# Altium schematic sheet uC.SchDoc
size A4
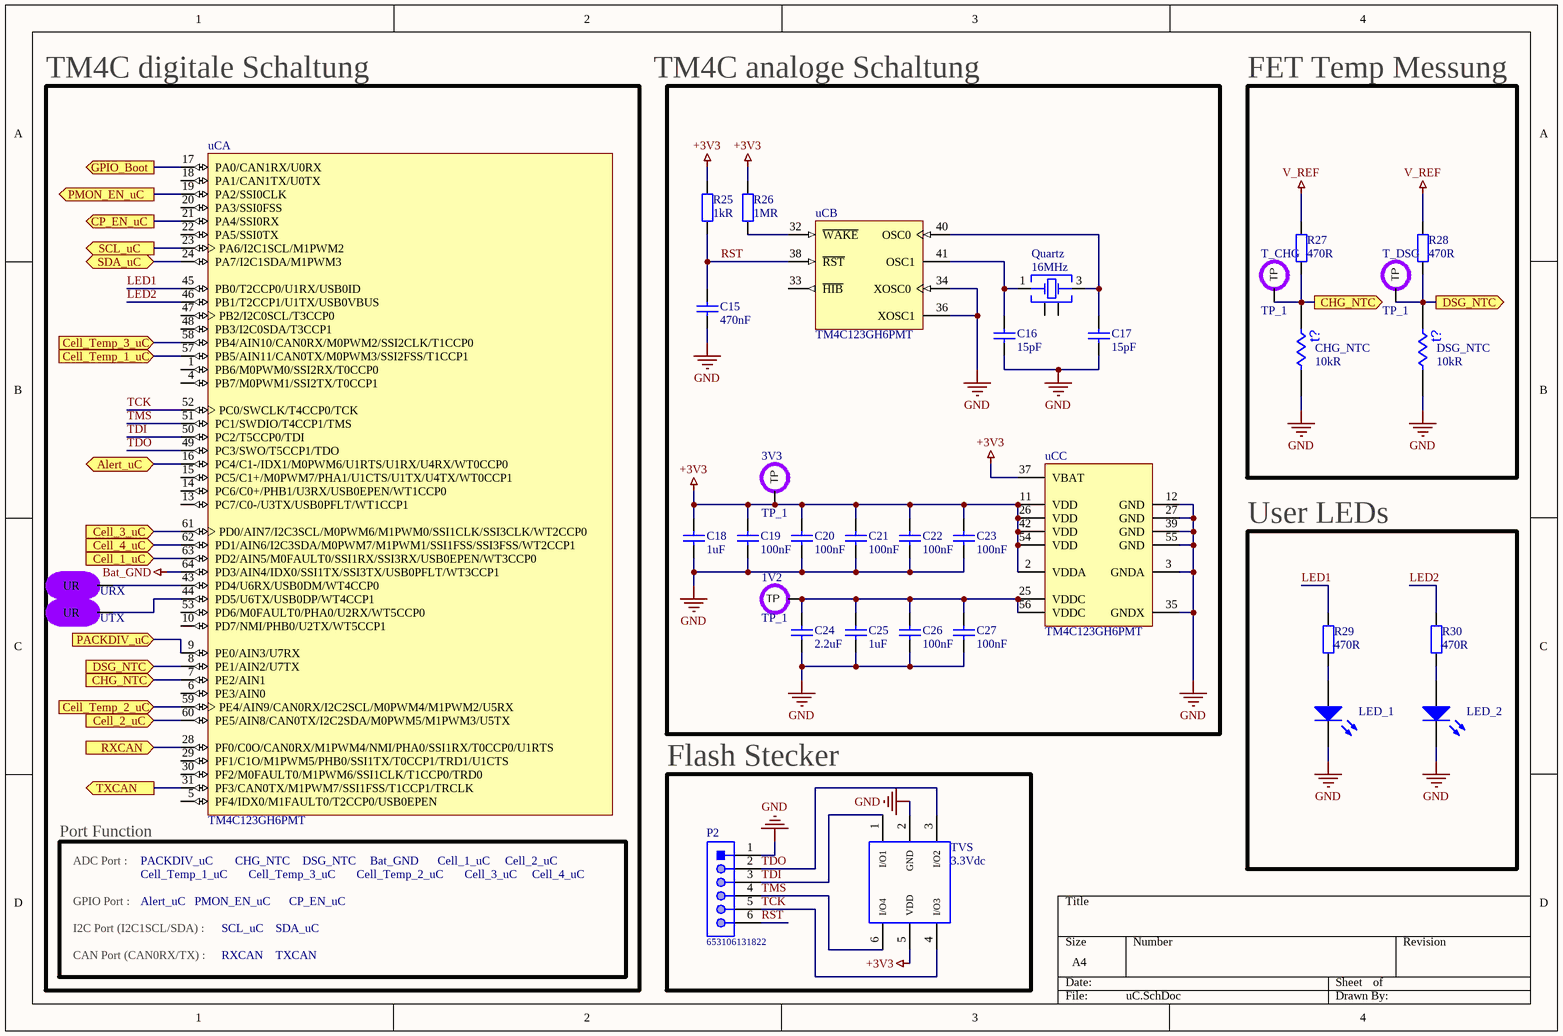
[diagram p0: uC.SchDoc]

## Parts
1V2  TP_1  [Test point]  (no BOM)
3V3  TP_1  [Test point]  (no BOM)
C15  470nF  [1608[0603]]
C16  15pF  [1608[0603]]
C17  15pF  [1608[0603]]
C18  1uF  [1608[0603]]
C19  100nF  [1608[0603]]
C20  100nF  [1608[0603]]
C21  100nF  [1608[0603]]
C22  100nF  [1608[0603]]
C23  100nF  [1608[0603]]
C24  2.2uF  [1608[0603]]
C25  1uF  [1608[0603]]
C26  100nF  [1608[0603]]
C27  100nF  [1608[0603]]
CHG_NTC  10kR  [J1-0603]
DSG_NTC  10kR  [J1-0603]
LED_1  (no value)  [1608[0603]]
LED_2  (no value)  [1608[0603]]
P2  653106131822  [653106131822]
Quartz  16MHz  [WE-XTAL_CFPX-180]
R25  1kR  [J1-0603]
R26  1MR  [J1-0603]
R27  470R  [J1-0603]
R28  470R  [J1-0603]
R29  470R  [J1-0603]
R30  470R  [J1-0603]
T_CHG  TP_1  [Test point]  (no BOM)
T_DSG  TP_1  [Test point]  (no BOM)
TVS  3.3Vdc  [WE-TVS_SOT23-6L]
uC  TM4C123GH6PMT  [PM0064A_L]  (parts A,B,C of 3)
URX  UR  [UR Pad]  (value not drawn)
UTX  UR  [UR Pad]  (value not drawn)

## Blocks framed on the sheet
TM4C digitale Schaltung: uC URX UTX
FET Temp Messung: CHG_NTC DSG_NTC R27 R28 T_CHG T_DSG
User LEDs: LED_1 LED_2 R29 R30
Flash Stecker: P2 TVS

## Ports
Alert_uC (bidir), Cell_1_uC (in), Cell_2_uC (in), Cell_3_uC (in), Cell_4_uC (in), Cell_Temp_1_uC (in), Cell_Temp_2_uC (in), Cell_Temp_3_uC (in), CHG_NTC (in), CHG_NTC (out), CP_EN_uC (out), DSG_NTC (in), DSG_NTC (out), GPIO_Boot (out), PACKDIV_uC (in), PMON_EN_uC (out), RXCAN (in), SCL_uC (out), SDA_uC (bidir), TXCAN (out)

## Nets
+3V3: 3V3.1(TP) C18.1 C19.1 C20.1 C21.1 C22.1 C23.1 R25.1 R26.1 TVS.5(VDD) uC.2(VDDA) uC.11(VDD) uC.26(VDD) uC.37(VBAT) uC.42(VDD) uC.54(VDD)
Bat_GND: uC.64(PD3/AIN4/IDX0/SSI1TX/SSI3TX/USB0PFLT/WT3CCP1)
GND: C15.2 C16.2 C17.2 C18.2 C19.2 C20.2 C21.2 C22.2 C23.2 C24.2 C25.2 C26.2 C27.2 CHG_NTC.2 DSG_NTC.2 LED_1.2(K) LED_2.2(K) P2.1 TVS.2(GND) uC.3(GNDA) uC.12(GND) uC.27(GND) uC.34(XOSC0) uC.35(GNDX) uC.36(XOSC1) uC.39(GND) uC.55(GND)
V_REF: R27.1 R28.1
Alert_uC: uC.16(PC4/C1-/IDX1/M0PWM6/U1RTS/U1RX/U4RX/WT0CCP0) ; port Alert_uC
Cell_1_uC: uC.63(PD2/AIN5/M0FAULT0/SSI1RX/SSI3RX/USB0EPEN/WT3CCP0) ; port Cell_1_uC
Cell_2_uC: uC.60(PE5/AIN8/CAN0TX/I2C2SDA/M0PWM5/M1PWM3/U5TX) ; port Cell_2_uC
Cell_3_uC: uC.61(PD0/AIN7/I2C3SCL/M0PWM6/M1PWM0/SSI1CLK/SSI3CLK/WT2CCP0) ; port Cell_3_uC
Cell_4_uC: uC.62(PD1/AIN6/I2C3SDA/M0PWM7/M1PWM1/SSI1FSS/SSI3FSS/WT2CCP1) ; port Cell_4_uC
Cell_Temp_1_uC: uC.57(PB5/AIN11/CAN0TX/M0PWM3/SSI2FSS/T1CCP1) ; port Cell_Temp_1_uC
Cell_Temp_2_uC: uC.59(PE4/AIN9/CAN0RX/I2C2SCL/M0PWM4/M1PWM2/U5RX) ; port Cell_Temp_2_uC
Cell_Temp_3_uC: uC.58(PB4/AIN10/CAN0RX/M0PWM2/SSI2CLK/T1CCP0) ; port Cell_Temp_3_uC
CHG_NTC: CHG_NTC.1 R27.2 T_CHG.1(TP) uC.7(PE2/AIN1) ; port CHG_NTC
CP_EN_uC: uC.21(PA4/SSI0RX) ; port CP_EN_uC
DSG_NTC: DSG_NTC.1 R28.2 T_DSG.1(TP) uC.8(PE1/AIN2/U7TX) ; port DSG_NTC
GPIO_Boot: uC.17(PA0/CAN1RX/U0RX) ; port GPIO_Boot
LED1: R29.1 uC.45(PB0/T2CCP0/U1RX/USB0ID)
LED2: R30.1 uC.46(PB1/T2CCP1/U1TX/USB0VBUS)
PACKDIV_uC: uC.9(PE0/AIN3/U7RX) ; port PACKDIV_uC
PMON_EN_uC: uC.19(PA2/SSI0CLK) ; port PMON_EN_uC
RST: C15.1 P2.6 R25.2 uC.38(~{RST})
RXCAN: uC.28(PF0/C0O/CAN0RX/M1PWM4/NMI/PHA0/SSI1RX/T0CCP0/U1RTS) ; port RXCAN
SCL_uC: uC.23(PA6/I2C1SCL/M1PWM2) ; port SCL_uC
SDA_uC: uC.24(PA7/I2C1SDA/M1PWM3) ; port SDA_uC
TCK: P2.5 TVS.4(I/O3) uC.52(PC0/SWCLK/T4CCP0/TCK)
TDI: P2.3 TVS.1(I/O1) uC.50(PC2/T5CCP0/TDI)
TDO: P2.2 TVS.3(I/O2) uC.49(PC3/SWO/T5CCP1/TDO)
TMS: P2.4 TVS.6(I/O4) uC.51(PC1/SWDIO/T4CCP1/TMS)
TXCAN: uC.31(PF3/CAN0TX/M1PWM7/SSI1FSS/T1CCP1/TRCLK) ; port TXCAN
Net1V2_1: 1V2.1(TP) C24.1 C25.1 C26.1 C27.1 uC.25(VDDC) uC.56(VDDC)
NetC16_1: C16.1 Quartz.1(Crystal) uC.41(OSC1)
NetC17_1: C17.1 Quartz.3(Crystal) uC.40(OSC0)
NetLED_1_1: LED_1.1(A) R29.2
NetLED_2_1: LED_2.1(A) R30.2
NetR26_2: R26.2 uC.32(~{WAKE})
NetuC_43: uC.43(PD4/U6RX/USB0DM/WT4CCP0) URX.1(UR)
NetuC_44: uC.44(PD5/U6TX/USB0DP/WT4CCP1) UTX.1(UR)

Not connected (* = marked no-connect by the designer): Quartz 2(GND) 4(GND); uC 1(PB6/M0PWM0/SSI2RX/T0CCP0) 4(PB7/M0PWM1/SSI2TX/T0CCP1) 5(PF4/IDX0/M1FAULT0/T2CCP0/USB0EPEN) 6(PE3/AIN0) 10(PD7/NMI/PHB0/U2TX/WT5CCP1) 13(PC7/C0-/U3TX/USB0PFLT/WT1CCP1) 14(PC6/C0+/PHB1/U3RX/USB0EPEN/WT1CCP0) 15(PC5/C1+/M0PWM7/PHA1/U1CTS/U1TX/U4TX/WT0CCP1) 18(PA1/CAN1TX/U0TX) 20(PA3/SSI0FSS) 22(PA5/SSI0TX) 29(PF1/C1O/M1PWM5/PHB0/SSI1TX/T0CCP1/TRD1/U1CTS) 30(PF2/M0FAULT0/M1PWM6/SSI1CLK/T1CCP0/TRD0) 33(~{HIB}) 47(PB2/I2C0SCL/T3CCP0) 48(PB3/I2C0SDA/T3CCP1) 53(PD6/M0FAULT0/PHA0/U2RX/WT5CCP0)

## Notes on the sheet
- TM4C analoge Schaltung
- (near uC) Port Function
- GPIO Port :
- ADC Port :
- PACKDIV_uC
- Cell_Temp_1_uC
- Alert_uC
- PMON_EN_uC
- CHG_NTC
- Cell_Temp_3_uC
- CP_EN_uC
- DSG_NTC
- Cell_Temp_2_uC
- Bat_GND
- Cell_1_uC
- Cell_3_uC
- Cell_2_uC
- Cell_4_uC
- I2C Port (I2C1SCL/SDA) :
- CAN Port (CAN0RX/TX) :
- RXCAN
- SCL_uC
- TXCAN
- SDA_uC
- (in symbol Res Thermal) t?

## Library data of the parts
1V2 = Test point: Power Supply for logical circuit
3V3 = Test point: Power Supply for uC
C15-C27 = Cap: Capacitor; Value: 220nF; Published: 8-Jun-2000; LatestRevisionDate: 17-Jul-2002; LatestRevisionNote: Re-released for DXP Platform.; PackageReference: RAD-0.3; Publisher: Altium Limited; PackageDescription: Radial Cap, Thru-Hole; 2 Leads; 0.3 in Pin Spacing
CHG_NTC DSG_NTC = Res Thermal: Thermistor; Published: 24-Mar-1999; LatestRevisionDate: 29-May-2009; LatestRevisionNote: IPC-7351 Footprint Added.; PackageVersion: Mar-2003; PackageReference: 6-0805; Publisher: Altium Limited; PackageDescription: Chip Resistor 0805 Case Size; Code_IPC: RESC2012
LED_1 LED_2 = LED0: Typical INFRARED GaAs LED; Published: 8-Jun-2000; LatestRevisionDate: 08-Jul-2005; LatestRevisionNote: Mech Layer 1 removed.; PackageReference: LED-0; Publisher: Altium Limited; PackageDescription: LED; 2 Leads
P2 = CMP-1502-00775-1: Male Shrouded Header WR-WTB, SMT, Right Angled, pitch 1.25 mm, 1 x 6 position; Manufacturer: Wurth Elektronik; Position: 1x6; Pitch: 1.25mm; Contact Resistance: 20mOhm; Working Voltage: 125VAC; Publisher: WurthElektronik; Package Reference: 653106131822; Operating Temperature: -40to85degC; Orientation: RightAngled; Mounting Technology: SMT; Manufacturer URL: http://www.we-online.de; Gender: Male; Packaging: TapeandReel; Part Number: 653106131822; Datasheet URL: https://katalog.we-online.de/em/datasheet/6531xx131822.pdf
Quartz = 830108207109: WE-XTAL Quartz Crystal, SMT, CFPX-180, 16MHz, +/-10ppm; Manufacturer: Wurth Elektronik; Frequency Stability: +/-20ppm; Load Capacitance: 8pF; ComponentLink1Description: Manufacturer; ComponentLink1URL: http://www.we-online.de; ComponentLink2Description: Datasheet; ComponentLink2URL: https://katalog.we-online.com/pbs/datasheet/830108207109.pdf; Operating Temperature: -40 to +85degC; Packaging: Tape and Reel; Manufacturer Part Number: 830108207109; Published Date: July 2020; Size: CFPX-180; Frequency: 16MHz; Frequency Tolerance: +/-10ppm; Mounting Technology: SMT
R25-R30 = Res2: Resistor; Value: 10kR; Published: 8-Jun-2000; LatestRevisionDate: 17-Jul-2002; LatestRevisionNote: Re-released for DXP Platform.; PackageReference: AXIAL-0.4; Publisher: Altium Limited; PackageDescription: Axial Device, Thru-Hole; 2 Leads; 0.4 in Pin Spacing
T_CHG T_DSG = Test point
TVS = 824013: WE-TVS TVS Diode - High Speed Series, SOT23-6L, 4+1Channel, 3.3Vdc; Manufacturer: Wurth Elektronik; Reverse Breakdown Voltage min.: 4.5V; Channel: 4+1; Channel Input Capacitance: 3pF; Reverse Peak Pulse Current: 12A; Reverse Channel Leakage Current: 5uA; DC Operating Voltage: 3.3V; ComponentLink1Description: Manufacturer; ComponentLink1URL: http://www.we-online.de; ComponentLink2Description: Datasheet; ComponentLink2URL: https://www.we-online.com/catalog/datasheet/824013.pdf; Manufacturer Part Number: 824013; Published Date: April 2020; Size: SOT23-6L; Operating Temperature: -40 to +125degC; Mounting Technology: SMT; Packaging: Tape and Reel
uC = CMP-0945-00001-2: Tiva C Series Microcontroller, 256 KB Flash, 32 KB SRAM, 12 Bit, 12 Channels, -40 to 105 degC, 64-Pin LQFP (PM), Green (RoHS & no Sb/Br); Manufacturer: Texas Instruments; Tiva Series: Connected MCUs; Prefix: Qualified Device; I2C: 2; Max Speed: 80 MHz; GPIOs: 43; ADC Resolution: 12 Bit; Program Memory: 256 KB; UART: 4; Data Memory: 32 KB; ADC Channels: 12; ComponentLink2URL: http://www.ti.com/lit/ds/symlink/tm4c123gh6pm.pdf; ComponentLink1URL: http://www.ti.com/; ComponentLink2Description: Datasheet; PackageVersion: 4040152/C; ComponentLink3URL: http://www.ti.com/litv/pdf/mtqf008a; Temperature Range: -40 to 105 degC; Mounting Technology: Surface Mount; RoHS: TRUE; DatasheetVersion: Rev. 15741.2722; PackageReference: PM0064A; ComponentLink1Description: Manufacturer URL; PartNumber: TM4C123GH6PMT; PackageDescription: 64-Pin Plastic Quad Flatpack, Body 10 x 10 mm, Pitch 0.5 mm; ComponentLink3Description: Package Specification
URX UTX = UR Pad